# Altium schematic sheet Vss.SchDoc
size A
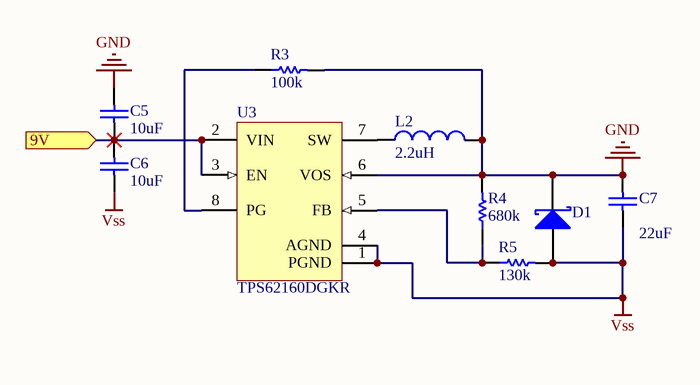
[diagram p0: Vss.SchDoc]

## Parts
C5  value 10uF  [C1206]  (hidden comment: Cap)
C6  value 10uF  [C1206]  (hidden comment: Cap)
C7  value 22uF  [C1206]  (hidden comment: Cap)
D1  D Schottky  [425]  (value not drawn)
L2  value 2.2uH  [1608[0603]]  (hidden comment: Inductor)
R3  value 100k  [C1206]  (hidden comment: Res1)
R4  value 680k  [C1206]  (hidden comment: Res1)
R5  value 130k  [C1206]  (hidden comment: Res1)
U3  TPS62160DGKR  [DGK8_N]

## Ports
9V (in)

## Nets
GND: C5.2 C7.2 D1.2(K) L2.2 R3.2 R4.2 U3.6(VOS)
Vss: C6.1 C7.1 D1.1(A) R5.2 U3.1(PGND) U3.4(AGND)
9V: C5.1 C6.2 U3.2(VIN) U3.3(EN) ; port 9V
NetL2_1: L2.1 U3.7(SW)
NetR3_1: R3.1 U3.8(PG)
NetR4_1: R4.1 R5.1 U3.5(FB)

## Library data of the parts
C5-C7 = Cap: Capacitor; Published: 8-Jun-2000; LatestRevisionDate: 17-Jul-2002; LatestRevisionNote: Re-released for DXP Platform.; PackageReference: RAD-0.3; Publisher: Altium Limited; PackageDescription: Radial Cap, Thru-Hole; 2 Leads; 0.3 in Pin Spacing
D1 = D Schottky: Schottky Diode; Published: 8-Jun-2000; LatestRevisionDate: 17-Jul-2002; LatestRevisionNote: Re-released for DXP Platform.; PackageReference: SMB; Publisher: Altium Limited; PackageDescription: DO-214-AA/SMB; 2 C-Bend Leads; Body 5.3 x 3.6 mm, inc. leads (LxW); Code_JEDEC: DO-214-AA
L2 = Inductor: Code_IEC: 1005; Published: 8-Jun-2000; LatestRevisionDate: 29-May-2009; LatestRevisionNote: IPC-7351 Footprint Added.; PackageReference: 0402-A; Publisher: Altium Limited; PackageDescription: Chip Inductor; Code_JEITA: 0402
R3-R5 = Res1: Resistor; Published: 8-Jun-2000; LatestRevisionDate: 17-Jul-2002; LatestRevisionNote: Re-released for DXP Platform.; PackageReference: AXIAL-0.3; Publisher: Altium Limited; PackageDescription: Axial Device, Thru-Hole; 2 Leads; 0.3 in Pin Spacing
U3 = TPS62160DGKR: Buck Step Down Regulator with 3 to 17 V Input and 0.9 to 6 V Output, -40 to 85 degC, 8-Pin VSSOP (DGK), Green (RoHS & no Sb/Br); Manufacturer: Texas Instruments; Duty Cycle(Max)(%): 100; Iout(Max)(A): 1; Iq(Typ)(mA): 0.017; Rating: Catalog; SubFamily: Step-Down Regulator; Switch Current Limit(Typ)(A): 1.8; Synchronous Rectification: TRUE; Vin(Max)(V): 17; Vin(Min)(V): 3; Vout(Max)(V): 6; Vout(Min)(V): 0.9; DatasheetVersion: SLVSAM2A; PackageVersion: revE, May-2006; PackageReference: DGK8; PackageDescription: 8-Pin Thin Small Outline Package 3 x 3 mm Body ,0.65 mm Pitch; Supplier 1: Digi-Key; Supplier Part Number 1: TPS62160DGKR-ND; Supplier 2: Newark; Supplier Part Number 2: 92T2383; Supplier 3: Mouser; Supplier Part Number 3: 595-TPS62160DGKR; Eco-Plan: Green (RoHS & no Sb/Br); Regulated Outputs(#): 1; Topology: Buck; Mounting Technology: Surface Mount; Code_JEDEC: MO-187-AA; PartNumber: TPS62160DGKR; ComponentLink1Description: Datasheet; ComponentLink1URL: http://www.ti.com/general/docs/lit/getliterature.tsp?genericPartNumber=TPS62160&fileType=pdf; ComponentLink2Description: Package Specification; ComponentLink2URL: http://www.ti.com/lit/ml/mpds028d/mpds028d.pdf; ComponentLink3Description: URL Link1; ComponentLink3URL: Samples URL:http://www.ti.com/product/tps62160#samples